# EAGLE design Current Controller (EAGLE 8.3.2)
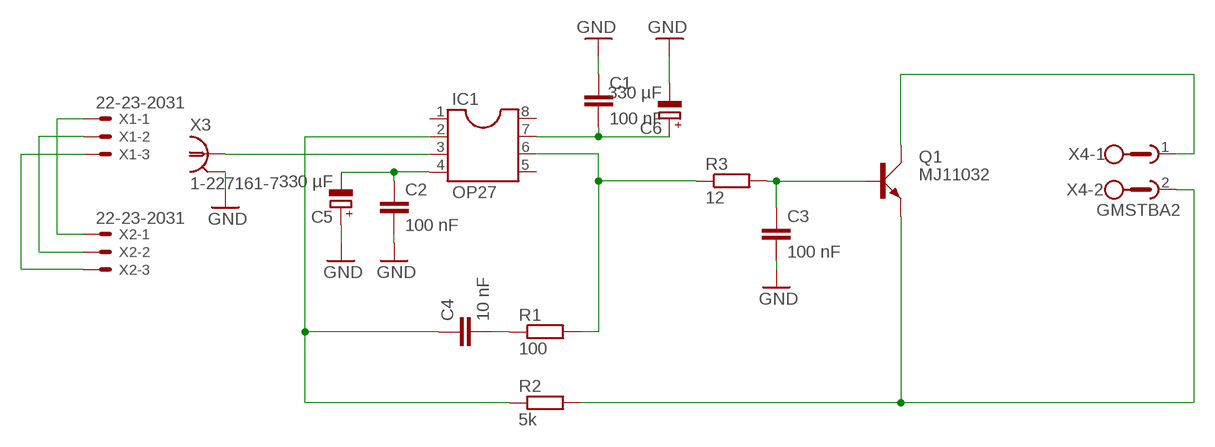
[diagram p0: schematic, sheet 1]

## Parts
C1  100 nF  C-EU025-050X050  [C025-050X050]
C2  100 nF  C-EU025-050X050  [C025-050X050]
C3  100 nF  C-EU025-050X050  [C025-050X050]
C4  10 nF  C-EU025-050X050  [C025-050X050]
C5  330 µF  CPOL-EUE5-8.5  [E5-8,5]
C6  330 µF  CPOL-EUE5-8.5  [E5-8,5]
IC1  OP27  DIL8  [DIL08]
Q1  MJ11032  2N3055  [TO3A]
R1  100  R-EU_0309/12  [0309/12]
R2  5k  R-EU_0309/12  [0309/12]
R3  12  R-EU_0309/12  [0309/12]
X1  22-23-2031  [22-23-2031]
X2  22-23-2031  [22-23-2031]
X3  1-227161-7  [AMP_227161]
X4  GMSTBA2  [GMSTBA2]

## Nets
-IN: C4.1 IC1.2 R2.1
BASE_VOLTAGE: C3.1 Q1.B R3.2
CURRENT_IN: Q1.C Q1.C1(C) X4.1
CURRENT_OUT: Q1.E R2.2 X4.2
GND: C1.1 C2.2 C3.2 C5.+ C6.- X1.2 X2.2 X3.2
N$5: C4.2 R1.1
OPAMP_OUT: IC1.6 R1.2 R3.1
SIG_IN: IC1.3 X3.1
V+: C1.2 C6.+ IC1.7 X1.1 X2.1
V-: C2.1 C5.- IC1.4 X1.3 X2.3
Unconnected: IC1.1 IC1.5 IC1.8

## Library data of the parts
C1-C4 = resistor:C-EU: CAPACITOR, European symbol
C5 C6 = resistor:CPOL-EU: POLARIZED CAPACITOR, European symbol
IC1 = ic-package:DIL8: Dual In Line / Socket
Q1 = transistor-power:2N3055: NPN TRANSISTOR
R1-R3 = resistor:R-EU_: RESISTOR, European symbol
X1 X2 = con-molex:22-23-2031: .100" (2.54mm) Center Header - 3 Pin; MF: MOLEX; MPN: 22-23-2031; OC_FARNELL: 1462950; OC_NEWARK: 30C0862
X3 = con-coax:?227161*: JACK, RIGHT ANGLE, 50 OHM, PCB, BNC Source: amp_227161.pdf; MF: TYCO ELECTRONICS; MPN: 1-227161-7; OC_FARNELL: unknown; OC_NEWARK: 09H7855
X4 = con-phoenix-762:GMSTBA2: PHOENIX; MF: FARNELL; MPN: 1757242; OC_FARNELL: 3705171; OC_NEWARK: 71C4161

## Board
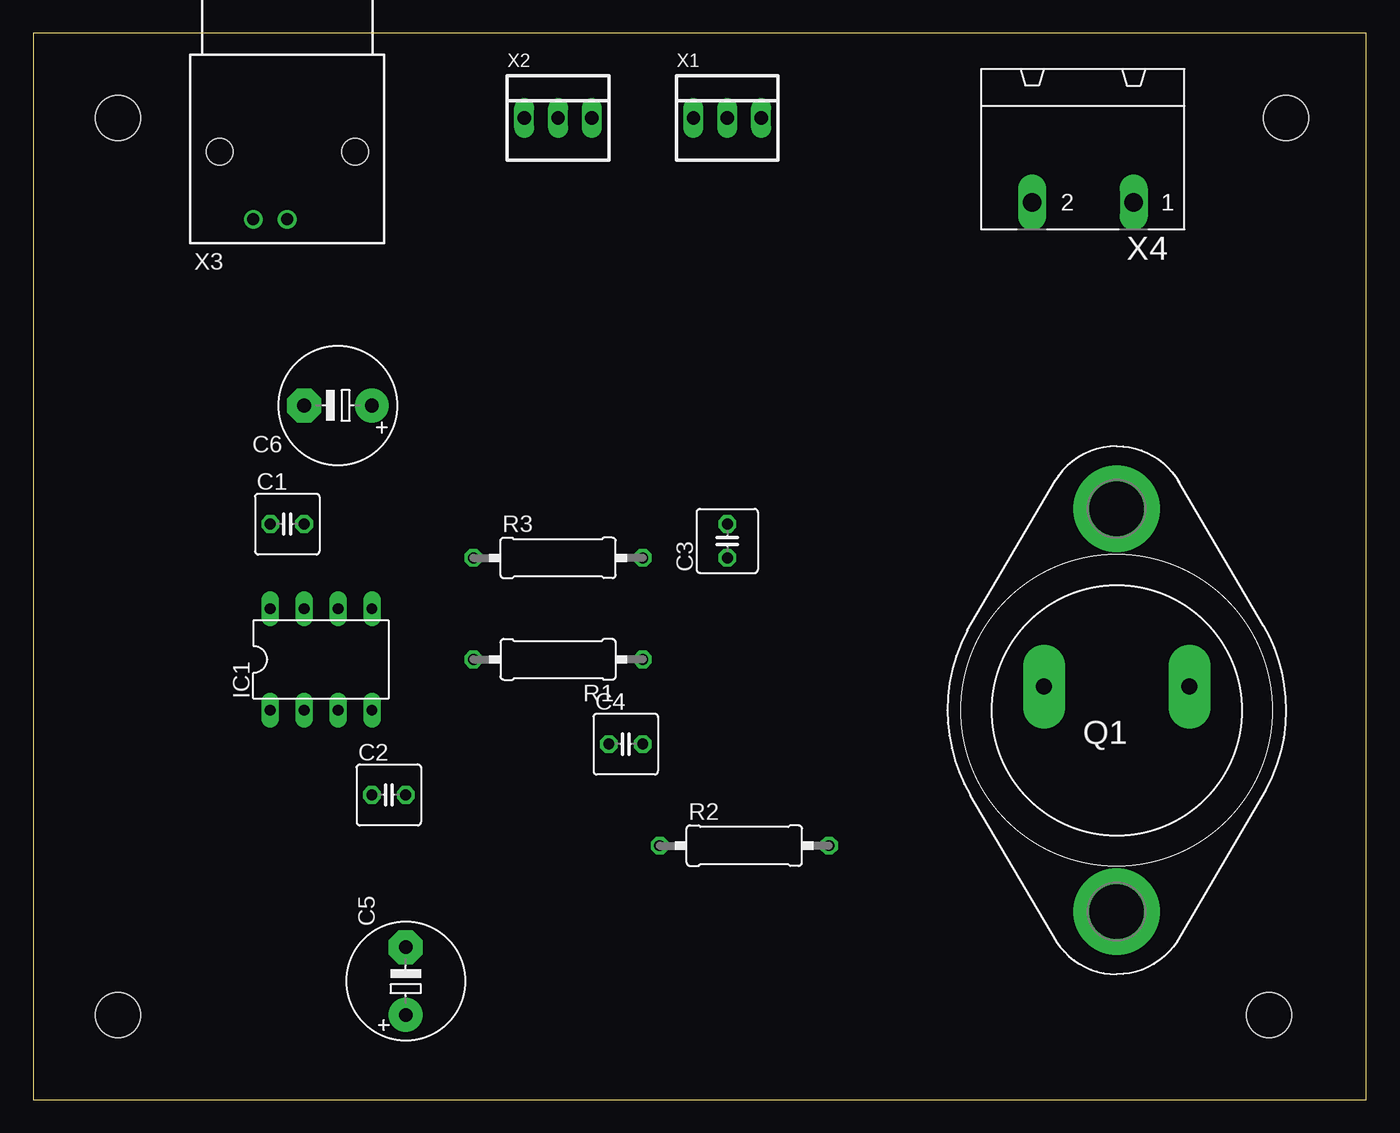
[diagram p1: board, top side]
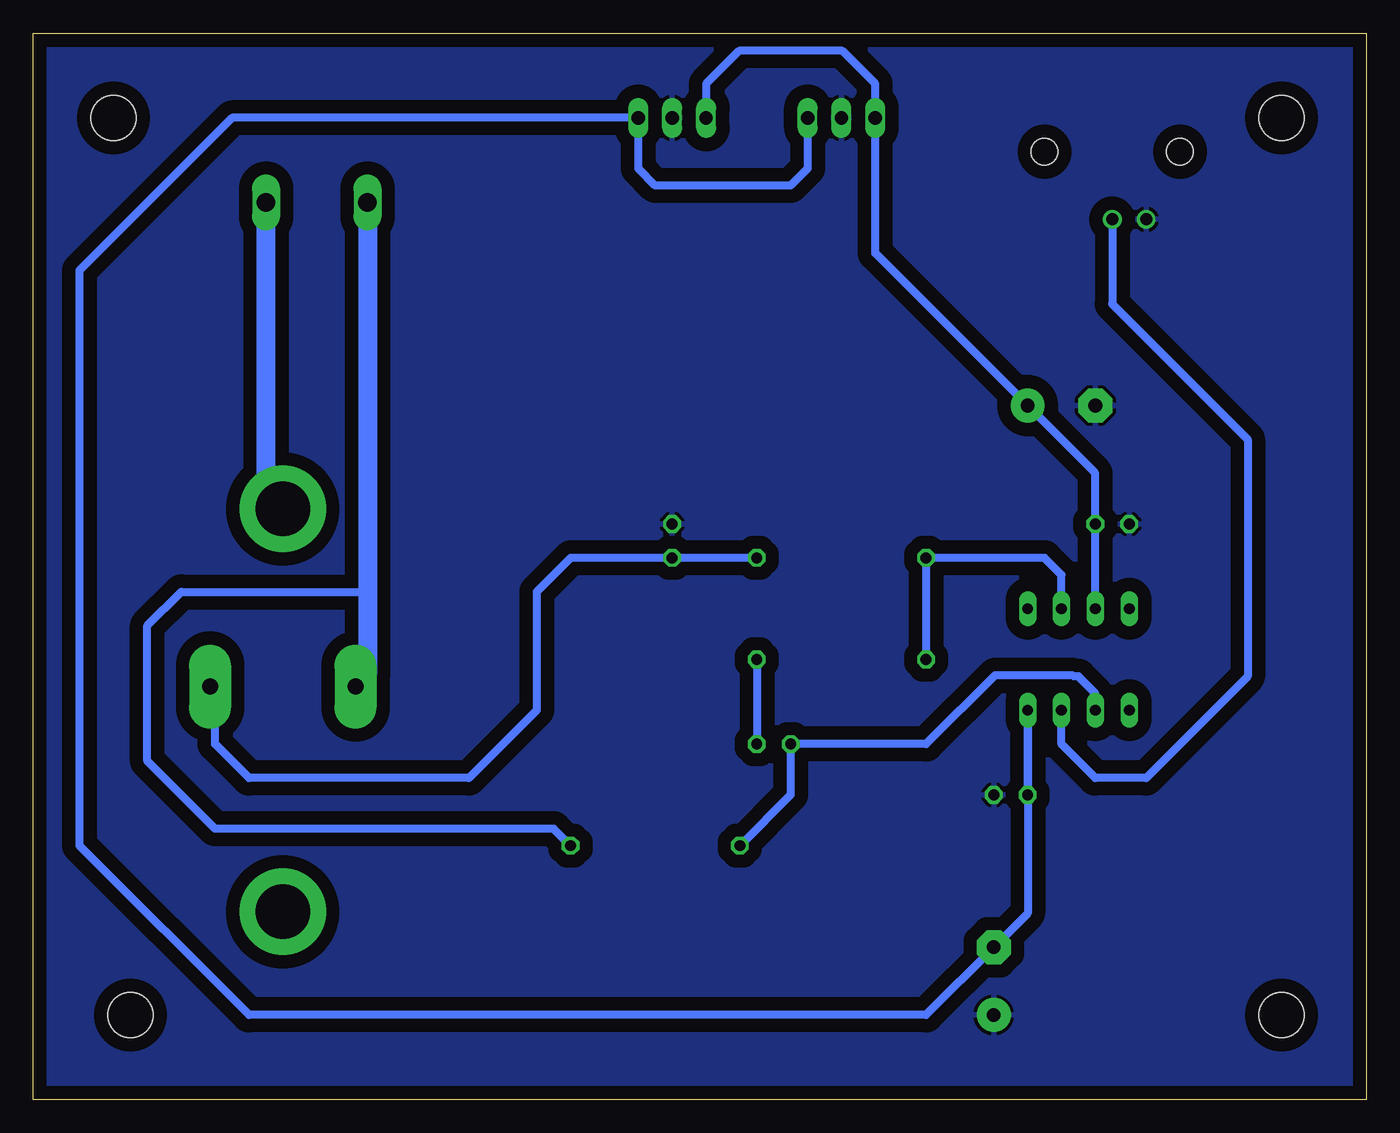
[diagram p2: board, bottom side, seen from below]

Size 100 x 80 mm. Coordinates in mm from the lower left corner, seen from the top.
Outline: 0,0 100,0 100,80 0,80 0,0
Copper layers (1*16): Top 0.035mm / dielectric 1.5mm / Bottom 0.035mm
Design rules "default *": minimum track width 6mil, minimum drill 0.35mm, track to track 1mm, track to pad 1mm, pad to pad 1mm, via to via 1mm, smd to smd 6mil, copper to edge 40mil, drill to drill 6mil, minimum pad ring 10mil, minimum via ring 8mil, stop-mask expansion 4mil, vias tented up to drill 0mil, thermal gap 10mil
Holes 3.4 mm at 6.35,73.66 6.35,6.35 92.71,6.35 93.98,73.66

### Footprints (pad centres in the part's own frame; a part is rotated, then mirrored left to right if it is on the bottom)
C025-050X050 = drill 0.813 octagon: 1 -1.27,0; 2 1.27,0
E5-8,5 = drill 1.016 pad 2.54: + -2.54,0 | drill 1.016 pad 2.54 octagon: - 2.54,0
DIL08 = drill 0.813 long: 1 -3.81,-3.81; 2 -1.27,-3.81; 3 1.27,-3.81; 4 3.81,-3.81; 5 3.81,3.81; 6 1.27,3.81; 7 -1.27,3.81; 8 -3.81,3.81
TO3A = drill 1.194 pad 3.15 long: B -1.778,5.461; E -1.778,-5.461 | drill 4.115 pad 6.477: C 15.113,0; C1 -15.113,0
0309/12 = drill 0.813 octagon: 1 -6.35,0; 2 6.35,0
22-23-2031 = drill 1 long: 1 -2.54,0; 2 0,0; 3 2.54,0
AMP_227161 = drill 0.9 pad 1.27: 1 0,-5.08; 2 -2.54,-5.08 | hole 2: -5.08,0; 5.08,0
GMSTBA2 = drill 1.397 long: 1 -3.81,5.08; 2 3.81,5.08

### Placement (x,y rotation side)
C1  19.05,43.18 0 top
C2  26.67,22.86 0 top
C3  52.07,41.91 90 top
C4  44.45,26.67 0 top
C5  27.94,8.89 90 top
C6  22.86,52.07 180 top
IC1  21.59,33.02 0 top
Q1  81.28,29.21 270 top
R1  39.37,33.02 180 top
R2  53.34,19.05 0 top
R3  39.37,40.64 0 top
X1  52.07,73.66 0 top
X2  39.37,73.66 0 top
X3  19.05,71.12 0 top
X4  78.74,72.39 180 top

### Tracks (layer width: path | path; a pad name or v marks a point on that pad's centre or on a via)
-IN
  Bottom 0.61: IC1.2 20.32,30.48 21.59,31.75 21.96,31.75 22.05,31.84 27.85,31.84 33.02,26.67 C4.1 43.18,22.86 R2.1
BASE_VOLTAGE
  Bottom 0.61: R3.2 C3.1 59.69,40.64 62.23,38.1 62.23,29.21 67.31,24.13 83.82,24.13 86.36,26.67 86.36,30.61 Q1.B
CURRENT_IN
  Bottom 1.422: Q1.C1 81.28,44.45 82.55,45.72 X4.1
CURRENT_OUT
  Bottom 0.61: 74.93,38.1 88.9,38.1 91.44,35.56 91.44,25.4 86.36,20.32 60.96,20.32 R2.2
  Bottom 0.813: 75.63,31.18 Q1.E
  Bottom 1.422: X4.2 74.93,38.1 74.93,31.88 75.63,31.18
GND
  pour Bottom: 0,0 100.33,0 100.33,78.74 99.06,80.01 0,80.01
N$5
  Bottom 0.61: R1.1 C4.2
OPAMP_OUT
  Bottom 0.61: IC1.6 22.86,39.37 24.13,40.64 R3.1 R1.2
SIG_IN
  Bottom 0.61: X3.1 19.05,59.69 8.89,49.53 8.89,31.75 16.51,24.13 20.32,24.13 22.86,26.67 IC1.3
V+
  Bottom 0.61: X1.1 49.53,76.2 47.05,78.68 39.31,78.68 36.83,76.2 X2.1 36.83,63.5 C6.+ 20.32,46.99 C1.2 IC1.7
V-
  Bottom 0.61: X2.3 41.91,69.85 43.18,68.58 53.34,68.58 54.61,69.85 X1.3 85.09,73.66 96.52,62.23 96.52,19.05 83.82,6.35 33.02,6.35 C5.- 25.4,13.97 IC1.4 C2.1